# EAGLE board signal_distribution_board (EAGLE 9.6.2), part 1 of 2
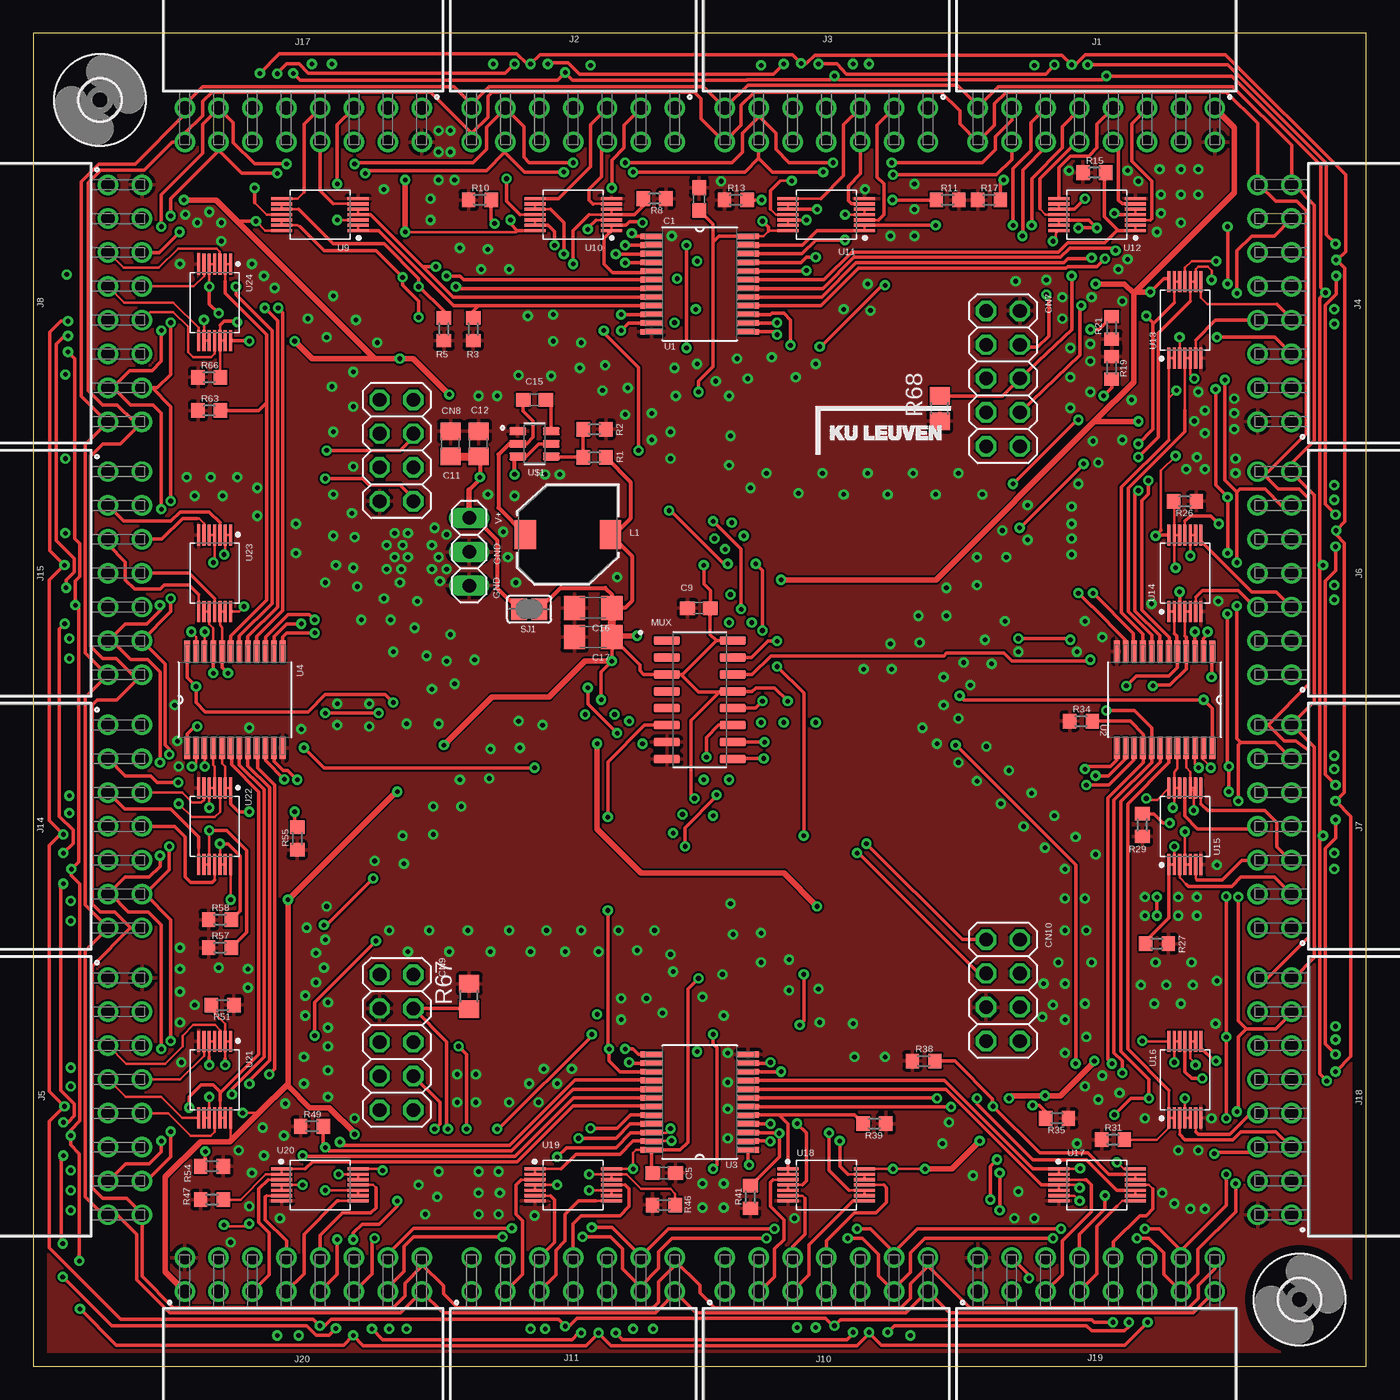
[diagram p9: board, top side]
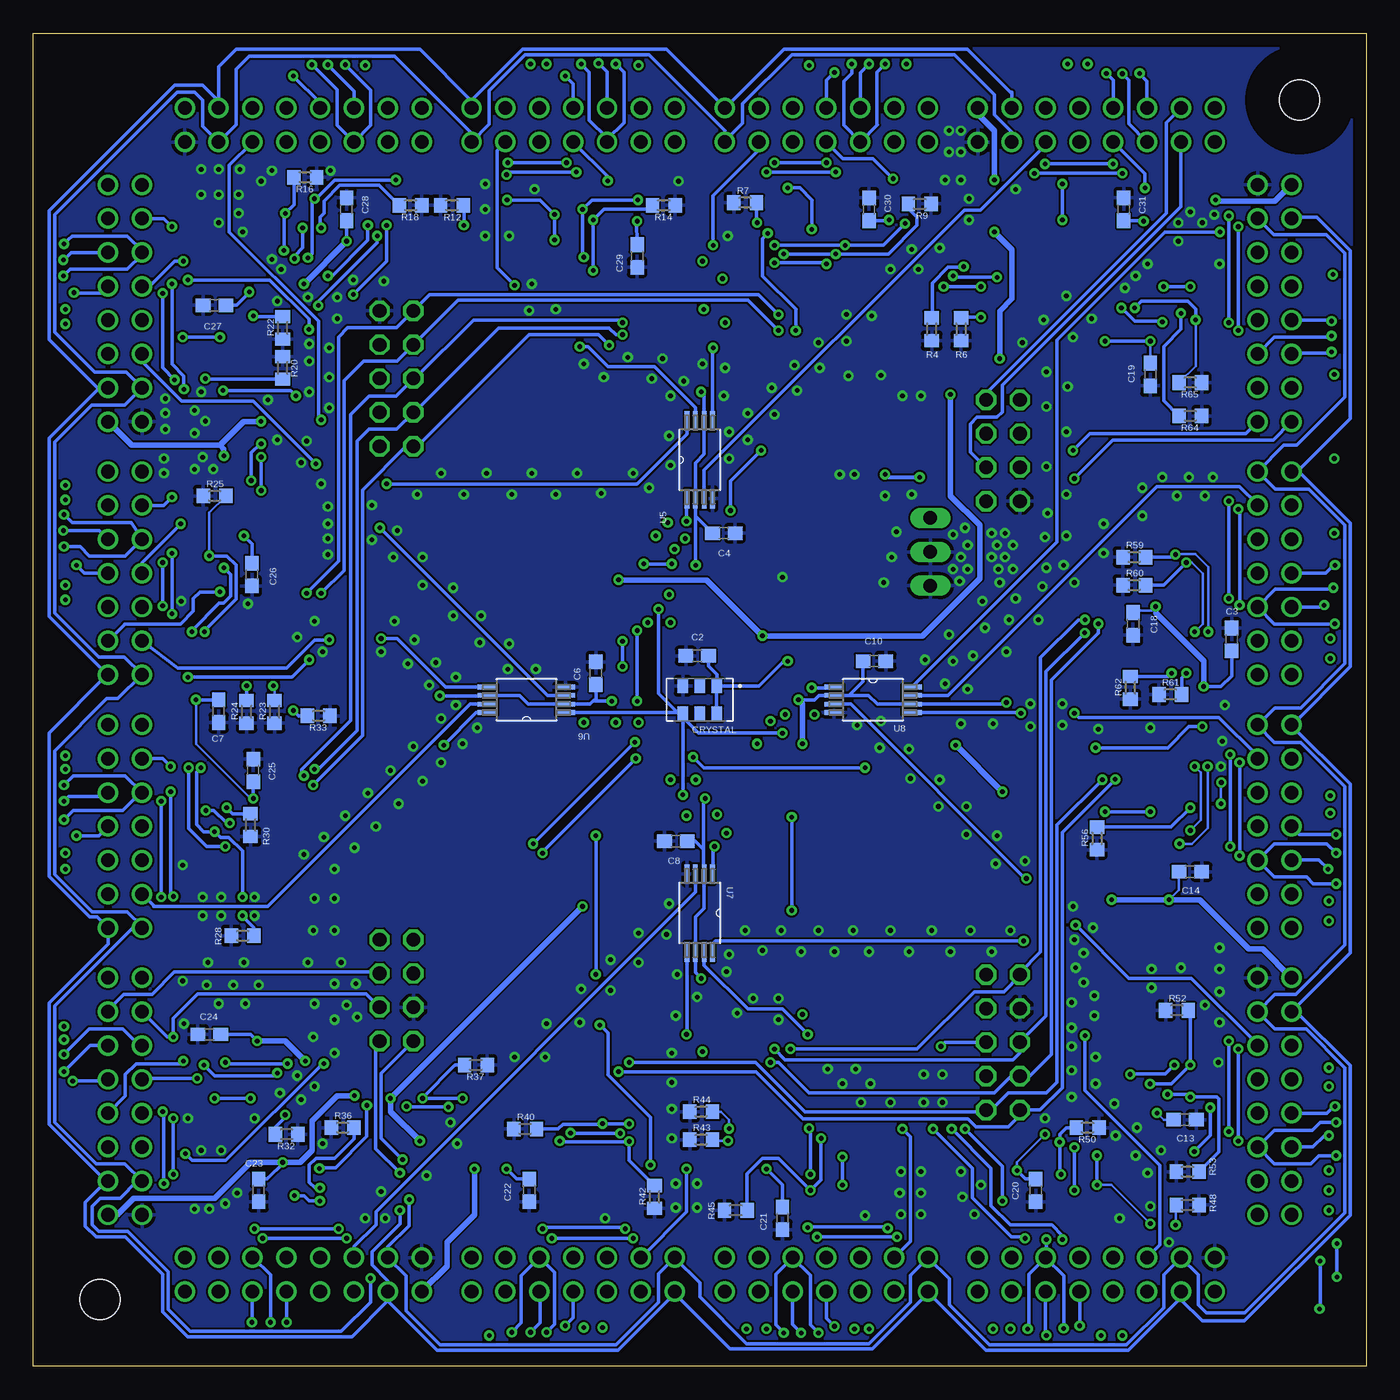
[diagram p10: board, bottom side, seen from below]

Size 100 x 100 mm. Coordinates in mm from the lower left corner, seen from the top.
Outline: 0,0 100,0 100,100 0,100 0,0
Copper layers (1*16): Top 0.035mm / dielectric 1.5mm / Bottom 0.035mm
Design rules "default": minimum track width 6mil, minimum drill 0.35mm, track to track 6mil, track to pad 6mil, pad to pad 6mil, via to via 6mil, smd to smd 6mil, copper to edge 40mil, drill to drill 6mil, minimum pad ring 10mil, minimum via ring 8mil, stop-mask expansion 4mil, vias tented up to drill 0mil, thermal gap 10mil

## Footprints (pad centres in the part's own frame; a part is rotated, then mirrored left to right if it is on the bottom)
C0603 = smd 1.1 x 1: 1 -0.85,0; 2 0.85,0
C0805 = smd 1.3 x 1.5: 1 -0.95,0; 2 0.95,0
C1206 = smd 1.6 x 1.8: 1 -1.4,0; 2 1.4,0
2X05 = drill 1.016 octagon: 1 -5.08,-1.27; 2 -5.08,1.27; 3 -2.54,-1.27; 4 -2.54,1.27; 5 0,-1.27; 6 0,1.27; 7 2.54,-1.27; 8 2.54,1.27; 9 5.08,-1.27; 10 5.08,1.27
2X04 = drill 1.016 octagon: 1 -3.81,-1.27; 2 -3.81,1.27; 3 -1.27,-1.27; 4 -1.27,1.27; 5 1.27,-1.27; 6 1.27,1.27; 7 3.81,-1.27; 8 3.81,1.27
OSC_ECX-H35CM-75.000 = smd 0.8 x 1.1: 1 -1.27,-1.05; 2 0,-1.05; 3 1.27,-1.05; 4 1.27,1.05; 5 0,1.05; 6 -1.27,1.05
3,0 = hole 3: 0,0
613016243121 = drill 1.02: 1 -8.89,5.61; 2 -8.89,8.15; 3 -6.35,5.61; 4 -6.35,8.15; 5 -3.81,5.61; 6 -3.81,8.15; 7 -1.27,5.61; 8 -1.27,8.15; 9 1.27,5.61; 10 1.27,8.15; 11 3.81,5.61; 12 3.81,8.15; 13 6.35,5.61; 14 6.35,8.15; 15 8.89,5.61; 16 8.89,8.15
613014243121 = drill 1.02: 1 -7.62,5.61; 2 -7.62,8.15; 3 -5.08,5.61; 4 -5.08,8.15; 5 -2.54,5.61; 6 -2.54,8.15; 7 0,5.61; 8 0,8.15; 9 2.54,5.61; 10 2.54,8.15; 11 5.08,5.61; 12 5.08,8.15; 13 7.62,5.61; 14 7.62,8.15
1X03 = drill 1.016 long: 1 -2.54,0; 2 0,0; 3 2.54,0
WE-PD_7345P = smd 1.6 x 2.2: 1 -3.2,0; 2 3.2,0
SOIC127P600X175-16N = smd 1.97 x 0.6: 1 -2.475,4.445; 2 -2.475,3.175; 3 -2.475,1.905; 4 -2.475,0.635; 5 -2.475,-0.635; 6 -2.475,-1.905; 7 -2.475,-3.175; 8 -2.475,-4.445; 9 2.475,-4.445; 10 2.475,-3.175; 11 2.475,-1.905; 12 2.475,-0.635; 13 2.475,0.635; 14 2.475,1.905; 15 2.475,3.175; 16 2.475,4.445
R0603 = smd 1 x 1.1: 1 -0.85,0; 2 0.85,0
R0805 = smd 1.3 x 1.5: 1 -0.95,0; 2 0.95,0
SJ = smd 1.168 x 1.6: 1 -0.762,0; 2 0.762,0
SOP65P780X200-24N = smd 1.651 x 0.432: 1 -3.632,3.581; 2 -3.632,2.921; 3 -3.632,2.286; 4 -3.632,1.626; 5 -3.632,0.965; 6 -3.632,0.33; 7 -3.632,-0.33; 8 -3.632,-0.965; 9 -3.632,-1.626; 10 -3.632,-2.286; 11 -3.632,-2.921; 12 -3.632,-3.581; 13 3.632,-3.581; 14 3.632,-2.921; 15 3.632,-2.286; 16 3.632,-1.626; 17 3.632,-0.965; 18 3.632,-0.33; 19 3.632,0.33; 20 3.632,0.965; 21 3.632,1.626; 22 3.632,2.286; 23 3.632,2.921; 24 3.632,3.581
SOP65P640X120-8N = smd 1.473 x 0.356: 1 -2.921,0.965; 2 -2.921,0.33; 3 -2.921,-0.33; 4 -2.921,-0.965; 5 2.921,-0.965; 6 2.921,-0.33; 7 2.921,0.33; 8 2.921,0.965
SOP40P640X120-14N = smd 1.57 x 0.24: 1 -2.87,1.2; 2 -2.87,0.8; 3 -2.87,0.4; 4 -2.87,0; 5 -2.87,-0.4; 6 -2.87,-0.8; 7 -2.87,-1.2; 8 2.87,-1.2; 9 2.87,-0.8; 10 2.87,-0.4; 11 2.87,0; 12 2.87,0.4; 13 2.87,0.8; 14 2.87,1.2
SOT95P280X110-6N = smd 1.25 x 0.59: 1 -1.255,0.95; 2 -1.255,0; 3 -1.255,-0.95; 4 1.255,-0.95; 5 1.255,0; 6 1.255,0.95

## Placement (x,y rotation side)
C1  1u  [C0603]  49.95,87.57 90 top
C2  100n  [C0603]  50.2,53.3 180 bottom
C3  1u  [C0603]  10.1,54.53 90 bottom
C4  100n  [C0603]  48.2,62.5 0 bottom
C5  1u  [C0603]  47.33,14.49 0 top
C6  100n  [C0603]  57.8,52 90 bottom
C7  1u  [C0603]  86.1,49.14 270 bottom
C8  100n  [C0603]  51.8,39.4 180 bottom
C9  100n  [C0603]  49.93,56.87 0 top
C10  100n  [C0603]  36.9,52.9 0 bottom
C11  10u  [C0805]  31.3,69.2 90 top
C12  10u  [C0805]  33.4,69.2 90 top
C13  100n  [C0603]  13.6,18.5 0 bottom
C14  100n  [C0603]  13.2,37.1 0 bottom
C15  100n  [C0603]  37.6,72.5 180 top
C16  22u  [C1206]  42,56.9 180 top
C17  22u  [C1206]  42,54.7 180 top
C18  100n  [C0603]  17.5,55.7 270 bottom
C19  100n  [C0603]  16.2,74.4 270 bottom
C20  100n  [C0603]  24.8,13.2 270 bottom
C21  100n  [C0603]  43.8,11.1 270 bottom
C22  100n  [C0603]  62.8,13.2 270 bottom
C23  100n  [C0603]  83.1,13.2 270 bottom
C24  100n  [C0603]  86.8,24.9 180 bottom
C25  100n  [C0603]  83.5,44.7 90 bottom
C26  100n  [C0603]  83.6,59.4 270 bottom
C27  100n  [C0603]  86.4,79.6 180 bottom
C28  100n  [C0603]  76.5,86.8 90 bottom
C29  100n  [C0603]  54.7,83.3 270 bottom
C30  100n  [C0603]  37.3,86.8 90 bottom
C31  100n  [C0603]  18.2,86.8 90 bottom
CN7  [2X05]  72.75,74.1 270 top
CN8  [2X04]  27.25,68.7 270 top
CN9  [2X05]  27.25,24.3 270 top
CN10  [2X04]  72.75,28.2 270 top
CRYSTAL  ECX-H35CM-75.000  [OSC_ECX-H35CM-75.000]  50,50 180 bottom
H1  MOUNT-HOLE3.0  [3,0]  5,95 0 top
H2  MOUNT-HOLE3.0  [3,0]  95,5 0 top
J1  [613016243121]  79.75,100 180 top
J2  [613014243121]  40.5,100 180 top
J3  [613014243121]  59.5,100 180 top
J4  [613016243121]  100,79.75 90 top
J5  [613016243121]  0,20.25 270 top
J6  [613014243121]  100,59.5 90 top
J7  [613014243121]  100,40.5 90 top
J8  [613016243121]  0,79.75 270 top
J10  [613014243121]  59.5,0 0 top
J11  [613014243121]  40.5,0 0 top
J14  [613014243121]  0,40.5 270 top
J15  [613014243121]  0,59.5 270 top
J17  [613016243121]  20.25,100 180 top
J18  [613016243121]  100,20.25 90 top
J19  [613016243121]  79.75,0 0 top
J20  [613016243121]  20.25,0 0 top
JP1  [1X03]  32.7,61.1 270 top
L1  3.3uH  [WE-PD_7345P]  40.1,62.4 0 top
MUX  CD74HC4052M96  [SOIC127P600X175-16N]  50,50 0 top
R1  33k  [R0603]  42.1,68.2 0 top
R2  10k  [R0603]  42.1,70.3 180 top
R3  1k  [R0603]  33,77.8 90 top
R4  1k  [R0603]  32.6,77.8 90 bottom
R5  1k  [R0603]  30.8,77.8 90 top
R6  1k  [R0603]  30.4,77.8 90 bottom
R7  1k  [R0603]  46.6,87.3 0 bottom
R8  1k  [R0603]  46.6,87.6 180 top
R9  1k  [R0603]  33.5,87.2 180 bottom
R10  1k  [R0603]  33.5,87.5 0 top
R11  1k  [R0603]  68.6,87.5 180 top
R12  1k  [R0603]  68.6,87.1 0 bottom
R13  1k  [R0603]  52.7,87.5 0 top
R14  1k  [R0603]  52.7,87.1 180 bottom
R15  1k  [R0603]  79.6,89.55 0 top
R16  1k  [R0603]  79.6,89.2 180 bottom
R17  1k  [R0603]  71.7,87.5 0 top
R18  1k  [R0603]  71.7,87.1 180 bottom
R19  1k  [R0603]  80.9,74.9 270 top
R20  1k  [R0603]  81.3,74.9 270 bottom
R21  1k  [R0603]  80.9,77.9 90 top
R22  1k  [R0603]  81.3,77.9 90 bottom
R23  1k  [R0603]  81.9,49.1 90 bottom
R24  1k  [R0603]  84,49.1 90 bottom
R25  1k  [R0603]  86.4,65.3 0 bottom
R26  1k  [R0603]  86.4,64.9 180 top
R27  1k  [R0603]  84.3,31.7 180 top
R28  1k  [R0603]  84.3,32.3 0 bottom
R29  1k  [R0603]  83.2,40.6 90 top
R30  1k  [R0603]  83.7,40.6 90 bottom
R31  1k  [R0603]  81,17 0 top
R32  1k  [R0603]  81,17.4 180 bottom
R33  1k  [R0603]  78.6,48.8 180 bottom
R34  1k  [R0603]  78.6,48.4 0 top
R35  1k  [R0603]  76.8,18.6 180 top
R36  1k  [R0603]  76.8,17.9 0 bottom
R37  1k  [R0603]  66.8,22.6 180 bottom
R38  1k  [R0603]  66.8,22.9 0 top
R39  1k  [R0603]  63.1,18.2 180 top
R40  1k  [R0603]  63.1,17.8 0 bottom
R41  1k  [R0603]  53.8,12.7 90 top
R42  1k  [R0603]  53.4,12.7 90 bottom
R43  1k  [R0603]  49.9,17 0 bottom
R44  1k  [R0603]  49.9,19.1 0 bottom
R45  1k  [R0603]  47.3,11.7 0 bottom
R46  1k  [R0603]  47.3,12.1 0 top
R47  1k  [R0603]  13.4,12.5 0 top
R48  1k  [R0603]  13.4,12.1 180 bottom
R49  1k  [R0603]  20.9,18 0 top
R50  1k  [R0603]  20.9,17.9 180 bottom
R51  1k  [R0603]  14.2,27.1 180 top
R52  1k  [R0603]  14.2,26.7 0 bottom
R53  1k  [R0603]  13.4,14.6 0 bottom
R54  1k  [R0603]  13.4,15 180 top
R55  1k  [R0603]  19.8,39.6 90 top
R56  1k  [R0603]  20.2,39.6 90 bottom
R57  1k  [R0603]  14,31.4 0 top
R58  1k  [R0603]  14,33.5 0 top
R59  1k  [R0603]  17.4,60.7 0 bottom
R60  1k  [R0603]  17.4,58.6 0 bottom
R61  1k  [R0603]  14.7,50.4 0 bottom
R62  1k  [R0603]  17.7,50.9 90 bottom
R63  1k  [R0603]  13.2,71.7 0 top
R64  1k  [R0603]  13.2,71.3 180 bottom
R65  1k  [R0603]  13.2,73.8 180 bottom
R66  1k  [R0603]  13.2,74.2 0 top
R67  2.2k  [R0805]  32.7,27.75 90 top
R68  2.2k  [R0805]  68,71.85 90 top
SJ1  [SJ]  37.2,56.8 0 top
U1  CD74HC4067SM96  [SOP65P780X200-24N]  50,81.19 0 top
U2  CD74HC4067SM96  [SOP65P780X200-24N]  84.87,50 270 top
U3  CD74HC4067SM96  [SOP65P780X200-24N]  50,19.81 180 top
U4  CD74HC4067SM96  [SOP65P780X200-24N]  15.13,50 90 top
U5  CDCV304PW  [SOP65P640X120-8N]  50,68 90 bottom
U6  CDCV304PW  [SOP65P640X120-8N]  63,50 180 bottom
U7  CDCV304PW  [SOP65P640X120-8N]  50,34 270 bottom
U8  CDCV304PW  [SOP65P640X120-8N]  37,50 0 bottom
U9  SN74LV00ADGVR  [SOP40P640X120-14N]  21.5,86.4 180 top
U10  SN74LV00ADGVR  [SOP40P640X120-14N]  40.5,86.4 180 top
U11  SN74LV00ADGVR  [SOP40P640X120-14N]  59.5,86.4 180 top
U12  SN74LV00ADGVR  [SOP40P640X120-14N]  79.8,86.4 180 top
U13  SN74LV00ADGVR  [SOP40P640X120-14N]  86.4,78.5 90 top
U14  SN74LV00ADGVR  [SOP40P640X120-14N]  86.4,59.5 90 top
U15  SN74LV00ADGVR  [SOP40P640X120-14N]  86.4,40.5 90 top
U16  SN74LV00ADGVR  [SOP40P640X120-14N]  86.4,21.5 90 top
U17  SN74LV00ADGVR  [SOP40P640X120-14N]  79.8,13.6 0 top
U18  SN74LV00ADGVR  [SOP40P640X120-14N]  59.5,13.6 0 top
U19  SN74LV00ADGVR  [SOP40P640X120-14N]  40.5,13.6 0 top
U20  SN74LV00ADGVR  [SOP40P640X120-14N]  21.5,13.6 0 top
U21  SN74LV00ADGVR  [SOP40P640X120-14N]  13.6,21.5 270 top
U22  SN74LV00ADGVR  [SOP40P640X120-14N]  13.6,40.5 270 top
U23  SN74LV00ADGVR  [SOP40P640X120-14N]  13.6,59.5 270 top
U24  SN74LV00ADGVR  [SOP40P640X120-14N]  13.6,79.8 270 top
U$1  TPS562209  [SOT95P280X110-6N]  37.6,69.2 0 top

## Tracks (layer width: path | path; a pad name or v marks a point on that pad's centre or on a via)
+3V3  (via drill 0.35)
  Top 0.2: 36.1,85.1 36.2,85.1 36.3,85.2 | U19.14 v45,14.8 45,16 45.23,16.23 U3.24
  Top 0.203: U10.14 36.7,85.2 | v27.9,85.1 36.1,85.1 | U22.14 v14.8,35 | U21.14 14.8,16.9 | U20.14 26.09,14.8 v26.2,14.69 | v15.8,57 15.43,56.63 U23.14 | U18.14 v64.5,14.8 v66.9,14.8 | U17.14 81.8,14.8 v81.3,15.3 | U16.14 83.23,24.37 v83.2,24.4 | U13.14 85.2,81.6 | U12.14 76.7,84.97 76.7,84.6 v76.5,84.4 | U1.24 54.77,84.77 55.15,85.15 55.2,85.2 U11.14 | v85.7,68.3 84.6,67.2 84.6,62.77 | U15.14 84.33,42.5 83.6,42.5 v83.5,42.6 | U9.14 17.4,85.2 v16.7,85.9 | v15.7,19 16.9,19 16.95,19.05
  Top 0.254: MUX.3 48.7,51.91 51.24,54.45 | 51.24,54.45 MUX.16 | MUX.3 48.59,51.91 49.9,50.6 52.44,50.6 MUX.13 | U4.24 11.55,51.65 v12.2,51 12.2,49.8 12.9,49.1 20.6,49.1 21.9,50.4 26.4,50.4 v27,49.8 | U2.24 88.45,49.35 v87.8,50 69.8,50 v69.5,50.3 | C5.1 46.37,14.92 U3.24 48.53,16.23 49.1,16.8 49.1,28.3 v49.9,29.1 | U1.24 51.43,84.77 51,84.34 | v49.9,73.1 49.9,73.9 51,75 51,84.34 | 51.24,54.45 50.78,54.91 C9.2 50.8,56.89 50.8,58.2 50.3,58.7 v50.3,60.1 | MUX.13 51.53,50.63 49.34,48.44 49.34,42.86 v49.6,42.6 | MUX.3 45.8,51.91 45.5,52.2 45.5,52.6 C17.1 v43.4,52.9 42.6,52.1 v42.6,50 | MUX.13 53.94,50.63 54.2,50.9 55.6,50.9 v56.6,49.9 | U24.14 16.17,76.93 v16.2,76.9 | v83.8,80.6 84.8,81.6 85.2,81.6 | v54.7,85.9 55.15,85.45 55.15,85.15 | v35.8,86 35.8,85.7 36.3,85.2 36.7,85.2 | v16.7,85.9 15.3,85.9 15.25,85.95 | 51,84.34 51,85.67 C1.1 | U14.14 84.27,62.37 v84.2,62.3 84.6,62.7 84.6,62.77
  Top 0.305: R1.2 44.8,66.35 44.8,63.6 43.6,62.4 L1.2 44.9,60.8 44.9,57.4 44.4,56.9 C16.1 43.4,57.9 42.9,58.4 39.56,58.4 SJ1.2
  Top 0.406: v11.3,87.5 13.7,87.5 15.25,85.95 25.6,75.6 | v27.9,89 v27.9,85.1 | 25.6,75.6 v27.5,75.6 28.5,75.6 v31.2,72.9 | v19.6,76.9 20.9,75.6 25.6,75.6 | J20.1 9.9,7.07 9.9,14.2 12.54,16.84 14.74,16.84 14.8,16.9 16.95,19.05 19.1,21.2 | 19.1,21.2 v19.1,35 27.2,43.1 v27.3,43.1 | v24.1,17.4 24.1,17.5 22.2,19.4 20.74,19.4 19.1,21.04 19.1,21.2 | v71,16.9 68.9,14.8 v66.9,14.8 | v73.2,20.1 73.4,20.3 v75.9,20.3 77.06,20.3 79.6,22.84 v79.6,22.9 | J1.1 90.1,92.93 90.1,88.06 82.64,80.6 | 79.6,70.9 67.7,59 v56.1,59 | v79.7,81.2 81.86,81.2 82.55,80.51 | v82.92,70.89 79.61,70.89 79.6,70.9 | v45.3,54.8 43.5,54.8 C17.1 | v30.8,46.6 34.4,50.2 38.7,50.2 41.4,52.9 v43.4,52.9 | v58.8,34.5 56.3,37 45.6,37 42.3,40.3 v42.3,46.7 | 82.55,80.51 82.55,73.85 79.6,70.9 | v83.8,80.6 82.64,80.6 | 82.64,80.6 82.55,80.51
  Top 0.61: C17.1 C16.1
  Bottom 0.203: v26.2,14.69 26.2,15.3 v24.1,17.4 | v87.8,50 87.8,46.7 83.7,42.6 v83.5,42.6 | C19.1 v16.2,76.9 | v15.8,57 16.1,56.7 17.35,56.7 C18.1 | C14.1 14.05,35.75 v14.8,35 | C13.1 15.2,18.5 v15.7,19
  Bottom 0.254: U5.2 50.33,67.77 49.67,68.43 U5.6 49.67,72.87 v49.9,73.1 | 38.8,50.33 U8.2 41.07,50.33 41.4,50 v42.6,50 | 38.8,50.33 37.33,50.33 36.67,49.67 U8.6 27.13,49.67 v27,49.8 | v12.2,51 10.9,51 10.1,51.8 C3.1 | v87.8,50 87.3,50 87.29,49.99 C7.1 | v69.5,50.3 65.95,50.3 U6.6 63.53,50.33 62.87,49.67 U6.2 58.23,49.67 58,49.9 | v49.9,29.1 50.33,29.53 U7.6 50.33,33.7 49.67,34.35 U7.2 49.72,36.97 49.72,38.77 | CRYSTAL.1 CRYSTAL.6 | C2.1 49.35,52.55 48.7,51.9 48.7,51.08 CRYSTAL.1 | U5.2 50.33,60.13 v50.3,60.1 | v49.6,42.6 49.72,42.48 49.72,38.77 | CRYSTAL.1 45.55,51.05 43.7,52.9 v43.4,52.9 | v56.6,49.9 58,49.9 | C4.1 50.33,63.78 U5.2 | C6.1 57.8,50.1 58,49.9 | C8.1 50.35,39.4 49.72,38.77 | C10.1 37.75,51.38 38.8,50.33 | v16.2,76.9 v19.6,76.9 | C20.1 25.57,14.05 v26.2,14.69 | C21.1 43.8,13.6 v45,14.8 | C22.1 63.75,14.05 v64.5,14.8 | C23.1 82.45,14.05 81.2,15.3 | C24.1 83.7,24.9 v83.2,24.4 | C26.1 83.6,61.7 v84.2,62.3 | C27.1 84.75,79.6 83.8,80.55 v83.8,80.6 | C28.1 v76.5,84.4 | C29.1 54.75,85.95 v54.7,85.9 | C30.1 35.85,85.95 v35.8,86 | C31.1 16.75,85.95 v16.7,85.9 | v83.5,42.6 C25.1
  Bottom 0.406: J8.1 6.85,87.4 11.2,87.4 v11.3,87.5 | J17.1 29.14,93.94 27.9,92.7 v27.9,89 | v27.5,75.6 27.5,79.16 26.57,80.1 26.57,83.77 v27.9,85.1 | J5.1 7.77,31.3 8.8,31.3 12.5,35 v14.8,35 v19.1,35 | v12.2,51 12.2,52.9 15.8,56.5 v15.8,57 | J19.1 68.96,7.51 68.96,9.31 66.9,11.37 v66.9,14.8 | v71,16.9 73.2,19.1 v73.2,20.1 v58.8,34.5 | J18.1 93.69,11.36 92.45,12.6 86.4,12.6 83.7,15.3 v81.3,15.3 81.2,15.3 80,15.3 79.1,16.2 79.1,18.4 77.2,20.3 v75.9,20.3 | v83.2,24.4 81.1,24.4 v79.6,22.9 | v76.5,84.4 v79.7,81.2 | J4.1 92.63,69.1 86,69.1 | 86,69.1 84.22,70.89 v82.92,70.89 | 86,69.1 85.7,68.8 v85.7,68.3 | v31.2,72.9 31.2,65.3 29,63.1 29,59.1 33.3,54.8 v45.3,54.8 49.5,59 v56.1,59 | v30.8,46.6 v27.3,43.1 | v42.6,50 42.3,49.7 v42.3,46.7
A0_A  (via drill 0.35)
  Top 0.254: MUX.12 54.16,49.37 v54.7,49.9 | v45.4,68.7 45.4,74.9 42.8,77.5 v42.8,77.7 | U1.1 45.13,84.77 v44.9,85 | v47.7,64.2 47.8,64.2 51.8,60.2 v52.1,60.2 | v54.7,55.2 54.7,59.7 v54.2,60.2
  Bottom 0.254: v45.4,68.7 47.7,66.4 v47.7,64.2 | v42.8,77.7 42.8,79.3 45.3,81.8 45.3,84.6 v44.9,85 | v54.7,49.9 v54.7,55.2 | v54.2,60.2 v52.1,60.2
A1_A  (via drill 0.35)
  Top 0.254: MUX.14 52.48,51.9 53.93,51.9 55.34,53.3 68.3,53.3 68.5,53.5 72.8,53.5 73.4,52.9 79.2,52.9 v79.3,53 | v88.4,51.7 88.4,53.58 U2.1
  Bottom 0.254: v79.3,53 80.6,51.7 v88.4,51.7
A2_A  (via drill 0.35)
  Top 0.254: MUX.15 53.88,53.17 55.1,54.4 v55.8,54.4 | v53.7,15.1 53.63,15.17 U3.1 | v57.8,39.8 57.8,50.5 v55.8,52.5 | v57.8,29.4 57.8,25.9 v57.5,25.6
  Bottom 0.254: v55.8,54.4 v55.8,52.5 | v57.5,25.6 56.9,25 56.9,21.87 53.7,18.67 v53.7,15.1 | v57.8,39.8 v57.8,29.4
A3_A  (via drill 0.35)
  Top 0.254: v50.5,45.7 50.5,47.19 51.41,48.09 MUX.11 | v37.6,44.9 21.8,44.9 v20.3,46.4 | v12.3,48 12.1,48 11.55,47.45 U4.1
  Bottom 0.254: v50.5,45.7 49.7,44.9 v37.6,44.9 | v20.3,46.4 14.9,46.4 13.3,48 v12.3,48
DIN_2  (via drill 0.35)
  Top 0.254: v18.3,96.96 18.3,97 19,97.7 19.94,97.7 20.64,97 35.4,97 v36.1,97.7 | v38.6,97.7 38.7,97.8 40.11,97.8 40.99,96.91 55.51,96.91 v56.3,97.7 | v58.9,97.7 60.3,97.7 61,96.93 75.96,96.93 v76.6,97.64 | v97.74,81.8 97.76,81.78 97.76,80.43 96.92,79.59 96.92,64.68 v97.7,63.9 | v97.7,61.5 97.7,59.7 96.92,58.92 96.92,44.38 v97.7,43.6 | v97.7,23.4 96.92,24.18 96.92,38.83 97.72,39.63 97.72,40.98 v97.7,41 | v97.7,84.2 97.01,84.89 97.01,90.27 89.63,97.64 v79.1,97.64 | CN7.8 78.53,75.87 78.53,79.47 v78.62,79.58 | J1.12 75.94,91.45 74.24,89.75 74.24,84.84 v74.2,84.8
  Bottom 0.254: v18.3,96.96 17.8,96.46 17.8,93.21 J17.12 | v38.6,97.7 38.6,97 39.2,96.4 39.2,93.09 J2.10 36.68,93.13 36.7,93.16 36.7,97.1 v36.1,97.7 | v58.9,97.7 58.3,97.1 58.3,93.49 56.96,92.15 J3.10 56.96,92.05 55.7,93.31 55.7,97.1 v56.3,97.7 | v79.1,97.64 77.21,95.75 77.21,93.12 J1.12 74.7,93.09 74.7,95.74 v76.6,97.64 | v97.7,84.2 97.1,84.8 92.96,84.8 91.85,83.69 J4.12 91.85,83.39 92.94,82.3 97.24,82.3 v97.74,81.8 | v97.7,63.9 97.1,63.3 92.67,63.3 J6.10 93.09,60.8 95.8,60.8 96.5,61.5 v97.7,61.5 | v97.7,41 97,41.7 93.29,41.7 91.95,43.04 J7.10 93.11,44.3 97,44.3 v97.7,43.6 | v97.7,23.4 95.8,25.3 93.3,25.3 92.06,24.06 J18.12 | v78.62,79.58 78.62,79.88 74.2,84.3 v74.2,84.8
DIN_5  (via drill 0.35)
  Top 0.254: v2.26,36.2 2.06,36 2.06,20.71 3.09,19.68 3.09,18.77 2.61,18.3 v2.26,18.3 | v2.36,55.7 1.96,55.3 1.96,41.24 2.99,40.21 2.99,39.23 v2.26,38.5 | v2.6,77.3 2.3,77.3 1.7,76.7 1.7,61.96 3.06,60.6 3.06,59.6 2.46,59 v2.46,58.4 | v82.2,3.3 82.2,2.97 81.87,2.64 79.4,2.64 79,3.04 64.6,3.04 v64.1,2.54 | v43.7,2.5 44.2,2 61.06,2 61.5,2.44 v61.5,2.54 | v25.4,2.8 26.2,2 40.4,2 40.9,2.5 v41.1,2.5 | v22.7,2.84 22.2,2.34 21.2,2.34 20.5,3.04 5.86,3.04 v2.2,6.7 | v2.2,9.2 2.1,9.3 2.1,15.64 v2.26,15.8 | CN9.8 30.5,19.78 30.5,18.2 v30.1,17.8 | v24,9.5 24,10 24.66,10.66 25.96,10.66 27.3,12 v27.3,12.4
  Bottom 0.254: v2.26,36.2 3.96,36.2 4.46,36.7 6.89,36.7 J14.10 6.91,39.2 2.96,39.2 v2.26,38.5 | v2.26,18.3 3.46,18.3 4.06,17.7 6.89,17.7 J5.12 6.91,15.2 4.16,15.2 3.56,15.8 v2.26,15.8 | v2.6,77.3 2.7,77.2 6.89,77.2 J8.12 | v2.46,58.4 2.56,58.3 6.81,58.3 J15.10 6.89,55.7 v2.36,55.7 | v82.2,3.3 82.2,6.86 83.49,8.15 J19.12 | v64.1,2.54 63.4,3.24 63.4,6.78 62.04,8.14 J10.10 61.99,8.15 60.9,7.06 60.9,3.14 v61.5,2.54 | v43.7,2.5 44.3,3.1 44.3,6.89 J11.10 43.02,8.15 41.7,6.83 41.7,3.1 v41.1,2.5 | v25.4,2.8 25.3,2.9 25.3,6.91 J20.12 | v2.2,6.7 v2.2,9.2 | J20.12 22.7,6.79 v22.7,2.84 | J20.12 24,8.21 v24,9.5 | v30.1,17.8 27.3,15 v27.3,12.4
FSELECT  (via drill 0.35)
  Top 0.254: v72.5,14.5 v72.5,11.7
  Bottom 0.254: J17.3 26.6,95.6 26.7,95.6 29.91,98.81 43.69,98.81 J2.1 48.12,94.42 52.51,98.81 63.29,98.81 67.12,94.97 J3.1 67.12,94.92 71,98.8 84.8,98.8 86.1,97.5 J1.3 86.1,94.9 87.3,96.1 89.4,96.1 98.81,86.69 98.81,77.01 95.2,73.4 J4.3 95.02,73.4 98.81,69.61 98.81,56.23 94.45,51.88 J6.1 94.44,51.88 98.81,47.51 98.81,45.99 98.81,45.83 98.81,45.82 98.81,36.73 95.77,33.69 95.2,33.69 J7.1 94.39,31.68 98.81,27.26 98.81,18.13 94.58,13.9 J18.3 94.5,13.9 96.1,12.3 96.1,10.5 95.3,9.7 93.1,9.7 90.3,6.9 90.3,4.1 88.4,2.2 76.1,2.2 73.4,4.9 J19.3 | J19.3 73.43,5.58 73.43,4.91 69.71,1.19 56.13,1.19 51.88,5.45 51.88,5.46 | 51.88,5.46 47.71,1.29 37.05,1.29 32.88,5.46 32.88,5.56 | 51.88,5.46 J10.1 | 32.88,5.56 J11.1 | 32.88,5.56 28.51,1.19 17.83,1.19 13.9,5.12 J20.3 13.9,5 12.3,3.4 9.12,3.4 1.19,11.33 1.19,22.57 5.22,26.6 J5.3 1.19,31.02 1.19,43.67 5.61,48.09 J14.1 5.56,48.12 1.19,52.49 1.19,63.27 5.04,67.12 J15.1 5.16,67.12 1.19,71.09 1.19,83.69 3.7,86.2 5.51,86.2 J8.3 | J19.3 73.4,6.41 74.6,7.61 74.6,8.6 72.5,10.7 v72.5,11.7 | v72.5,14.5 74.32,16.32 74.32,24.09 CN10.8
FSYNC1_A  (via drill 0.35)
  Top 0.203: v22.8,86 U9.3
  Top 0.254: v22.8,88.7 22.8,93.13 J17.5
  Bottom 0.254: v22.8,88.7 v22.8,86
FSYNC1_B  (via drill 0.35)
  Top 0.203: U13.3 v86,77.2
  Top 0.254: v88.8,77.2 93.16,77.2 94.39,75.97 J4.5
  Bottom 0.254: v86,77.2 v88.8,77.2
FSYNC1_C
  Top 0.203: U17.3 78.9,14
  Top 0.254: J19.5 77.2,6.87 77.2,9.4 79.38,11.58 79.38,13.62 79,14 78.9,14
FSYNC1_D
  Top 0.203: J5.5 6.97,22.7 9.9,22.7 11.2,24 11.2,24.8 12,25.6 13.63,25.6 14.03,25.21 14.03,24.4 U21.3
FSYNC2_A
  Top 0.203: U9.6 22.5,87.2
  Top 0.254: 22.5,87.2 21.52,88.18 J17.8
FSYNC2_B
  Top 0.203: U13.6 87.2,77
  Top 0.254: J4.8 88.68,78.48 87.2,77
FSYNC2_C  (via drill 0.35)
  Top 0.203: v78.5,12.4 78.1,12.8 U17.6
  Top 0.254: J19.8 78.48,9.9 80.39,11.81 80.39,12.8 v80.4,12.8
  Bottom 0.254: v80.4,12.8 79.7,12.8 79.3,12.4 v78.5,12.4
FSYNC2_D
  Top 0.203: J5.8 11.02,21.52 12.8,23.3 U21.6
FSYNC3_A
  Top 0.203: 20.3,88.07 19.83,87.6 U9.8
  Top 0.254: 20.3,88.07 20.3,93.17 J17.7
FSYNC3_B
  Top 0.203: 93.3,79.7 88.07,79.7 87.6,80.17 U13.8
  Top 0.254: 93.3,79.7 94.39,78.61 J4.7
FSYNC3_C
  Top 0.203: U17.8 81.7,12.4 81.3,12
  Top 0.254: 81.3,12 79.8,10.5 79.8,6.93 J19.7
FSYNC3_D
  Top 0.203: J5.7 6.93,20.2 9.6,20.2 11.17,18.63 U21.8
FSYNC4_A  (via drill 0.35)
  Top 0.203: U9.11 17.5,86.4 16.6,87.3
  Top 0.254: 16.6,87.3 v16.6,88.4
  Bottom 0.254: v16.6,88.4 16.6,89.47 J17.10
FSYNC4_B  (via drill 0.35)
  Top 0.203: U13.11 86.4,82.4 86.9,82.9 v88.74,82.9
  Bottom 0.254: J4.10 91.28,81.02 89.4,82.9 v88.74,82.9
FSYNC4_C
  Top 0.203: 84,13.3 83.7,13.6 U17.11
  Top 0.254: J19.10 81.02,9.32 83,11.3 83.5,11.3 84,11.8 84,13.3
FSYNC4_D
  Top 0.203: J5.10 10.12,18.98 11.8,17.3 13.3,17.3 13.6,17.6 U21.11
FSYNC5_A  (via drill 0.35)
  Top 0.203: 42.2,86 U10.3
  Top 0.254: 42.2,86 41.6,85.4 v41.6,85.3 | v43.4,88.4 43.4,90.5 44.3,91.4 44.3,93.11 J2.3
  Bottom 0.254: v41.6,85.3 41.6,87.5 42.5,88.4 v43.4,88.4
FSYNC5_B  (via drill 0.35)
  Top 0.254: U14.3 v86,58.1
  Bottom 0.254: J6.3 93.23,55.58 93.15,55.7 88.95,55.7 88,56.65 88,57.6 87.5,58.1 v86,58.1
FSYNC5_C
  Top 0.203: U18.3 55.5,14
  Top 0.254: 55.5,14 55.3,13.8 55.3,12 56.3,11 56.3,9.5 55.6,8.8 55.6,6.7 54.51,5.61 J10.3
FSYNC5_D  (via drill 0.35)
  Top 0.203: U22.3 14,41.6 13.6,41.2 11.9,41.2 v10.9,42.2 | 10.8,43.8 v10.87,43.8
  Top 0.254: J14.3 6.89,44.3 8.8,44.3 9.3,43.8 10.8,43.8
  Bottom 0.203: v10.87,43.8 10.9,43.77 v10.9,42.2
FSYNC6_A
  Top 0.203: 42.01,87.19 42.1,87.2 U10.6
  Top 0.254: 42.01,87.19 41.7,87.5 41.7,88.3 42.64,89.24 42.64,91.45 J2.6
FSYNC6_B
  Top 0.203: U14.6 87.2,57.7
  Top 0.254: J6.6 91.66,56.96 90.42,58.2 87.7,58.2 87.2,57.7
FSYNC6_C
  Top 0.203: U18.6 57.7,12.8 57.9,12.6
  Top 0.254: 57.9,12.6 57.9,9.89 56.96,8.95 J10.6
FSYNC6_D
  Top 0.203: U22.6 12.8,42.5 12.6,42.3 11.9,42.3 11.16,43.04 J14.6
FSYNC7_A
  Top 0.254: U10.8 39.3,87.6 39.39,87.59 41.8,90 41.8,93.15 J2.5
FSYNC7_B
  Top 0.203: U14.8 87.6,61.9
  Top 0.254: J6.5 94.39,56.98 93.27,58.1 91.4,58.1 87.6,61.9
FSYNC7_C
  Top 0.203: 61.5,12.4 U18.8
  Top 0.254: J10.5 58.2,6.85 58.2,9.1 61.5,12.4
FSYNC7_D
  Top 0.203: U22.8 12.4,38.9
  Top 0.254: J14.5 6.85,41.8 10.3,41.8 12.4,39.7 12.4,38.9
FSYNC8_A  (via drill 0.35)
  Top 0.203: 36.5,86.4 U10.11
  Top 0.254: 36.5,86.4 35.5,87.4 v35.5,89.1
  Bottom 0.254: v35.5,89.1 37,90.6 39.25,90.6 J2.8
FSYNC8_B  (via drill 0.35)
  Top 0.203: 86.4,63.4 U14.11
  Top 0.254: 86.4,63.4 86.8,63.8 88.34,63.8 v88.94,63.2
  Bottom 0.254: v88.94,63.2 91.85,60.29 J6.8
FSYNC8_C
  Top 0.203: 63.8,13.6 U18.11
  Top 0.254: J10.8 59.5,9.4 61.6,11.5 63.2,11.5 64,12.3 64,13.4 63.8,13.6
FSYNC8_D
  Top 0.203: 13.6,36.5 U22.11
  Top 0.254: J14.8 10.6,40.5 11.4,39.7 11.4,36.7 11.8,36.3 13.4,36.3 13.6,36.5
FSYNC9_A
  Top 0.203: U11.3 63.4,86
  Top 0.254: 63.4,86 63.8,86.4 63.8,88.7 63.3,89.2 63.3,93.11 J3.3
FSYNC9_B
  Top 0.203: U15.3 86,36.67 86.52,36.15
  Top 0.254: 86.52,36.15 86.67,36 89.9,36 90.6,36.7 93.11,36.7 J7.3
FSYNC9_C
  Top 0.203: 36.6,14 U19.3
  Top 0.254: J11.3 36.7,6.89 36.7,10.9 36.2,11.4 36.2,13.6 36.6,14
FSYNC9_D
  Top 0.203: U23.3 14,63.3
  Top 0.254: 14,63.3 13.2,64.1 11,64.1 10.3,63.4 6.79,63.4 J15.3
FSYNC10_A
  Top 0.254: U11.6 61.37,87.2 61.14,87.43 61.14,88.55 62.04,89.45 J3.6
FSYNC10_B
  Top 0.203: 87.3,36.5 87.2,36.6 U15.6
  Top 0.254: 87.3,36.5 89.19,36.5 90.65,37.96 J7.6
FSYNC10_C
  Top 0.203: U19.6 38.8,12.8
  Top 0.254: 38.8,12.8 39.1,12.5 39.1,9.29 J11.6
FSYNC10_D
  Top 0.203: 12.3,63.6 12.43,63.6 12.8,63.23 U23.6
  Top 0.254: J15.6 9.64,62.04 11.2,63.6 12.3,63.6
FSYNC11_A
  Top 0.203: U11.8 59.09,87.6
  Top 0.254: 59.09,87.6 60.8,89.3 60.8,93.15 J3.5
FSYNC11_B
  Top 0.203: U15.8 87.6,42.2
  Top 0.254: J7.5 94.29,37.96 93.3,38.95 93.3,40.8 92.4,41.7 88.1,41.7 87.6,42.2
FSYNC11_C
  Top 0.203: 42.2,12.4 U19.8
  Top 0.254: J11.5 39.2,6.85 39.2,8.7 39.9,9.4 39.9,11.4 40.9,12.4 42.2,12.4
FSYNC11_D
  Top 0.203: 12.4,57.9 U23.8
  Top 0.254: J15.5 5.61,61.64 6.9,60.35 6.9,59 7.6,58.3 9.5,58.3 9.8,58.6 11.7,58.6 12.4,57.9
FSYNC12_A  (via drill 0.35)
  Top 0.203: U11.11 55.7,86.4 55.3,86.8 | 56,88.9 56.03,88.93 v56.9,88.93
  Top 0.254: 55.3,86.8 55.3,88.2 56,88.9
  Bottom 0.254: v56.9,88.93 56.9,89.25 J3.8
FSYNC12_B
  Top 0.203: 86.4,42.47 U15.11
  Top 0.254: 86.4,42.47 86.4,41.27 87.35,40.32 91.67,40.32 J7.8
FSYNC12_C
  Top 0.203: U19.11 44.4,13.6
  Top 0.254: 44.4,13.6 44.7,13.3 44.7,12 44,11.3 41.1,11.3 40.5,10.7 J11.8
FSYNC12_D
  Top 0.203: U23.11 13.6,57.6
  Top 0.254: 13.6,57.6 11.7,59.5 J15.8
FSYNC13_A
  Top 0.2: 83.8,86 U12.3
  Top 0.254: 83.8,86 83.9,86.1 83.9,88.9 82.4,90.4 82.4,93.23 J1.5
FSYNC13_B
  Top 0.203: U16.3 86,17.4
  Top 0.254: 86,17.4 86.4,17 90,17 90.6,17.6 93.23,17.6 J18.5
FSYNC13_C
  Top 0.203: 17.6,14 U20.3
  Top 0.254: J20.5 17.7,6.87 17.7,10 16.9,10.8 16.9,13.3 17.6,14
FSYNC13_D
  Top 0.203: U24.3 13.97,82.7 13.97,83.63 13.75,83.85 10.85,83.85 9.4,82.4 6.77,82.4 J8.5
FSYNC14_A
  Top 0.254: U12.6 81.7,87.2 81.42,87.48 81.42,91.45 J1.8
FSYNC14_B
  Top 0.203: U16.6 87.2,17.6
  Top 0.254: 87.2,17.6 87.39,17.41 89.75,17.41 91.33,18.98 J18.8
FSYNC14_C
  Top 0.203: U20.6 17.5,12.8
  Top 0.254: 17.5,12.8 17.4,12.7 17.4,11 19,9.4 19,8.17 J20.8
FSYNC14_D
  Top 0.203: U24.6 12.8,81.8 12.02,81.02 J8.8
FSYNC15_A
  Top 0.254: J1.7 79.8,93.17 79.8,91.4 79.2,90.8 77.8,90.8 76.93,89.93 U12.8
FSYNC15_B  (via drill 0.35)
  Top 0.203: U16.8 87.6,23.9
  Top 0.254: 87.6,23.9 88.6,22.9 v88.74,22.9
  Bottom 0.254: v88.74,22.9 88.94,22.7 92.3,22.7 93.1,21.9 93.1,20.27 J18.7
FSYNC15_C
  Top 0.203: 22.9,12.4 U20.8
  Top 0.254: J20.7 20.3,6.93 20.3,9.9 22.8,12.4 22.9,12.4
FSYNC15_D
  Top 0.203: J8.7 6.83,79.8 10.5,79.8 12.4,77.9 U24.8
FSYNC16_A
  Top 0.2: U12.11 75.93,86.4 75.5,86.83
  Top 0.254: 75.5,86.83 75.5,89.1 78.25,91.85 J1.10
FSYNC16_B  (via drill 0.35)
  Top 0.254: U16.11 86.4,22.1 86.9,21.6 v87.7,21.6
  Bottom 0.254: J18.10 91.77,21.6 v87.7,21.6
FSYNC16_C
  Top 0.203: U20.11 25.5,13.6 25.7,13.4
  Top 0.254: 25.7,13.4 25.7,11.9 25.3,11.5 23.2,11.5 21.52,9.82 J20.10
FSYNC16_D
  Top 0.203: J8.10 8.77,79.1 10.5,79.1 11.6,78 11.6,76.1 12,75.7 13.33,75.7 13.6,75.97 U24.11
GND  (via drill 0.35)
  other vias: 12.3,85.8 14.1,84.4 22.5,80.3 24.2,78.5 20.6,78.6 14.1,85.8 22,77.2 25.8,76.8 24,74.6 22.4,73.5 24,72 22.5,70.1 24,67.5 22.5,65.4 23.9,64 24.1,62.2 22.5,62.3 19.7,63.2 19.7,61 16.8,63.8 14.2,65.3 13.3,66.7 12.1,65.3 15.3,66.7 11.5,66.7 21.9,58.8 22.7,60.1 24,59.9 26.5,59.8 28.8,57.4 26.3,57.6 24.3,58.5 24.6,56 27,53.6 26.8,56 28.6,55.4 31.3,54.9 33.1,53 31.6,51.2 31,52.9 29.5,53.3 29.9,50.8 28,48.2 30.4,48.2 25.2,48 25.2,49.7 22.8,48.1 20.1,47.8 22.8,49.7 16.2,47.9 10.8,46.9 10.6,49.6 26.3,88.3 29.8,87.6 29.8,86 32,83.9 34.1,83.8 33.6,82.3 35.7,82.3 37.1,78.8 39,78.9 41.1,76.8 39,76.9 42.9,75.1 41,74.9 44.6,73.4 42.7,73.2 44.4,71.4 46.4,71.5 47.8,70.1 46.4,69.5 47.8,68.1 48.2,72.8 48.1,74.9 47.9,84.8 51.6,88.9 66.1,88.7 66.1,86.8 66.1,84.8 64.3,84.8 62.6,81.2 62.8,79.2 60.8,79.3 58.7,75.2 57.2,74.2 55.4,75.7 52.8,75.6 53.6,74.1 52.2,72.8 51.2,73.9 49.8,75.2 52.3,69.8 52.2,67.6 55,67 53.8,65.9 59.2,67 57.4,65.5 60.8,65.4 62.6,67 64.1,65.4 66,67 67.7,65.4 69.4,67 71.2,65.4 81.4,82.3 81.7,79.9 79.4,80.2 79.3,76.7 79.3,75.4 77.2,78.6 77.2,80.2 76,81.5 84.3,85.1 86.1,85.8 86.1,87.9 73.7,81.4 90.1,72.6 87.4,73.1 81.7,69.5 82.4,72.5 77.8,76.4 77.8,74.2 79.3,73.1 77.8,71.9 79.5,69.4 79.9,67.8 78.4,66.2 74.6,64.6 74.6,62 72.7,62.7 73,60.7 70.8,60.7 70.8,58.6 68.5,58.4 68.5,56.3 66.4,56.3 66.5,54.3 64.3,54.2 64.4,52.3 62.3,52.3 80.2,54.7 78.9,55.9 72.9,55.9 78.3,53.6 73.9,53.6 71.4,54.5 71.9,52.7 69.8,52.8 70.3,51.1 68.3,51.7 68.3,49.6 69.4,48.6 66.7,47.9 67.8,46.7 69.4,45.3 71.5,46.5 73.2,44.7 70.8,43.9 72.6,42.2 74.9,43 76.6,41.3 74.3,40.5 78.2,39.7 79.7,38.4 75.9,38.9 77.4,37.3 78.9,35.1 77.4,35.1 77.4,32.7 79,32.7 79.4,30.3 76.9,30.3 75.8,28.7 77.4,28.7 76.5,27.1 77.4,26 75.7,26.2 78.9,27.2 79,24.7 80.2,21.8 77.4,23.5 78.9,21 83.4,35.2 83.4,33.8 85.9,35.2 85.9,33.8 87.3,35.2 87.3,33.8 88.8,28.9 86.9,30.3 84.2,30.3 83.1,28.6 85,28.6 88.7,25.7 87,28.6 86.1,27.2 84.1,27.2 87.4,16.2 85.9,16.2 81.5,20.5 83.4,18.6 79.9,20 75.1,11.1 73.6,11.1 70.5,14.3 68.2,16.7 68.7,18.3 63.9,23.2 61.6,23.2 61.5,25.7 58.9,28.3 59,25.8 56.7,28.2 56.7,30.5 54.6,30.3 54.6,32.5 52.3,34.7 52.5,32.4 51.8,11.9 50.2,11.9 51.8,13.7 50.2,13.7 52.1,17.1 52.1,19.3 52.1,21.3 52.1,23.5 51.8,26.3 50.2,27.7 51.7,29.4 47.8,30.9 48,29.6 46,27.6 47.2,26.5 44.1,27.6 44.1,26 43.9,32.7 45.3,31.2 46.6,32.7 42.4,31.1 41.1,32.7 38.5,32.7 39.9,31.1 37.3,31.1 35.7,32.7 34.3,31.1 32.6,32.7 31.2,31.1 29.7,32.7 28.1,31.1 26.7,32.7 38.3,22.3 37.2,21.2 40.4,22.3 33.4,13 35,13 33.4,11.4 28.9,13.6 33.2,19.8 31.8,19.8 33.2,21.9 31.8,21.9 24.1,18.6 22.1,20.2 22.1,22.2 22.1,27.3 21.2,28.8 20.4,27.8 22.1,25.4 20.4,26.3 20.3,23.2 22.1,24 20.3,21.2 18.8,17.3 17.2,17.9 17.3,15.8 15.4,16.2 16.4,14.5 16.2,12 14.8,9.3 11,25.8 11,28.1 13.9,29.9 12.1,27.1 16.1,28.4 16.1,29.8 21.9,32 20.5,32.9 22,34.5 25.6,37.9 27.8,37.7 27.7,39.8 30,39.9 32.1,42 30,42 32,44 34.2,44.1 36.5,46.4 34.3,46.3 38.2,48.1 36.4,48.4 34.1,65.4 35.6,60.7 35.25,62.6 38.4,66.9 39.5,66.9 36.1,65.3 36.2,58.8 43.8,59.2 33.4,72.8 34.8,72.8 36.4,74.35 38.85,74.3 86.1,89.8 84.5,89.8 82.1,89.7 82.9,88.9 84.6,87.9 62.4,88.3 30.3,12.7 39.3,21.2 37.9,19.8 35.7,19.8 33.4,14.6 34.9,14.6 34.9,11.4 30.4,14.6 29.4,11.4 18.9,19.7 11,82.7 11.1,22.8 37.6,11.3 57.1,11.1 73.9,13.1 88.8,37.6 18.5,11.1 82.1,83.05 88.4,18.6 10.9,45 16.8,65.9 30.4,91.1 30.4,92.7 31.3,92.7 31.3,91.1 87.4,89.8 87.4,87.9 30.4,89 31.6,89 30.1,62.9 29.9,61.6 30.4,60.7 29.9,59.8 31,59.8 31,62.4 30.5,58.9 28.1,62.5 27.7,61.6 28.1,60.7 27.6,59.8 27.5,58.8 27.1,62.5 26.5,61.6 27.1,60.7 11,29.8 11,31.4 21.2,31 21.8,29.9 84.7,13 85.6,12.2 86.8,11.8 87.9,11.8 87.9,70 87.9,71.7 87.1,70.9 87.3,68.2 86.5,67.3 87.9,67.3 77.9,64.5 77.9,63.2 77.9,62.1 77.9,60.9 84.6,86.5 13.2,86.6 11.4,86.4 16.4,82.7 17.3,81.8 18.1,80.9 90.1,71.5 90.1,70.3 90.2,68.1 90.2,67 77.7,89.7 88.9,57.4 83.9,57.2 78.3,16.7
  pour Bottom: 0,100 100,100 100,0 -0.1,0 -0.1,100
  pour Top: 0,100 0,0 100,0 100,100
I0_A
  Top 0.203: U9.2 U9.1
  Top 0.254: U1.9 33.4,79.56 | 33.4,79.56 31.54,79.56 25.9,85.2 U9.1 | R3.2 33,79.16 33.4,79.56
I0_B  (via drill 0.35)
  Top 0.2: v85.77,73.2 85.2,72.63 85.2,72.5
  Top 0.203: U13.2 U13.1 85.2,72.5 85.2,69.5
  Top 0.254: U2.9 83.24,54.93 81.64,56.53 81.64,65.94 85.2,69.5 | R19.2 80.9,73.4 v80.3,72.8
  Bottom 0.254: v80.3,72.8 80.7,73.2 v85.77,73.2
I0_C  (via drill 0.35)
  Top 0.2: U17.1 78.51,14.8 v78.54,14.83
  Top 0.203: U17.1 U17.2
  Top 0.254: U3.9 68.36,21.44 75,14.8 U17.1 | R35.2 75.95,19.1 75.48,19.57 v74.98,19.57
  Bottom 0.254: v78.54,14.83 78.5,14.87 77.33,14.87 74.98,17.23 v74.98,19.57
I0_D  (via drill 0.35)
  Top 0.2: R51.2 13.35,26.75 14.4,25.7 U21.2
  Top 0.203: U21.1 U21.2 14.4,23.1
  Top 0.254: U4.9 16.82,46.3 16.82,44.9 18.12,43.6 18.12,22.31 v17.7,21.9 | v14.4,22.6 14.4,23.1
  Bottom 0.254: v17.7,21.9 17.66,21.94 15.06,21.94 v14.4,22.6
I1_A  (via drill 0.35)
  Top 0.203: U9.5 U9.4
  Top 0.254: U1.8 31.48,80.22 29.2,82.5 | U9.4 25.3,86.4 29.2,82.5 | v30.2,82.5 29.2,82.5
  Bottom 0.254: R4.2 32.56,78.69 32.56,81.27 31.37,82.46 30.24,82.46 v30.2,82.5
I1_B  (via drill 0.35)
  Top 0.2: v87.1,74.1 86.8,74.4 U13.5
  Top 0.203: U13.5 U13.4 86.4,71.72
  Top 0.254: U2.8 83.91,54.85 82.15,56.6 82.15,65.88 86.4,70.12 86.4,71.72
  Bottom 0.254: R20.2 87.05,74.05 v87.1,74.1
I1_C  (via drill 0.35)
  Top 0.2: v78.5,13.37 78.27,13.6 U17.4
  Top 0.203: U17.4 U17.5
  Top 0.254: U3.8 68.45,20.77 75.62,13.6 U17.4
  Bottom 0.254: R36.2 75.95,17.05 77.4,15.6 78.8,15.6 79.3,15.1 79.3,13.8 78.87,13.37 v78.5,13.37
I1_D  (via drill 0.35)
  Top 0.203: U21.4 U21.5 13.2,23.2
  Top 0.254: U4.8 16.09,45.05 17.71,43.43 17.71,22.94 16.21,21.44 v16.21,21.18 | v13.2,22.6 13.2,23.2
  Bottom 0.254: v16.21,21.18 14.62,21.18 v13.2,22.6 13.2,26.55 R52.2
I2_A  (via drill 0.35)
  Top 0.203: U9.9 U9.10 19.9,86.8
  Top 0.254: U1.7 31.84,80.86 v31.7,81 | 19.9,86.8 22.5,84.2 26.3,84.2 28.9,81.6 v28.9,81 28.95,81 30.8,79.15 R5.2
  Bottom 0.254: v31.7,81 v28.9,81
I2_B  (via drill 0.35)
  Top 0.2: U13.9 87.2,82.3 87.4,82.5 88.1,82.5 88.4,82.2 v88.4,81.5
  Top 0.203: U13.9 U13.10 86.8,79.9
  Top 0.254: U2.7 84.5,53.67 84.5,54.83 82.66,56.67 82.66,65.45 v82.9,65.7 | v82.91,68.21 84.41,69.71 84.41,77.51 86.8,79.9 | R21.2 79.94,77.78 v79.31,77.78
  Bottom 0.254: v82.9,65.7 v82.9,68.2 v82.91,68.21 | v79.31,77.78 79.31,78.54 82.28,81.5 v88.4,81.5
I2_C  (via drill 0.35)
  Top 0.203: U17.10 U17.9
  Top 0.254: U3.7 67.76,20.14 v67.8,20.1 | v70.8,20.1 70.8,19.7 75,15.5 79,15.5 81.3,13.2 U17.10
  Bottom 0.254: v67.8,20.1 v70.8,20.1 70.8,20.15 68.35,22.6 R37.2
I2_D  (via drill 0.35)
  Top 0.203: U21.9 U21.10 13.2,19.9
  Top 0.254: U4.7 15.46,45.11 17.31,43.26 17.31,23.21 14.9,20.8 v14.9,20.4 | v13.2,20.2 13.2,19.9
  Bottom 0.254: v14.9,20.4 13.4,20.4 v13.2,20.2 11.2,20.2 11.05,20.05 11.05,16.1 R53.2
I3_A  (via drill 0.35)
  Top 0.203: U9.12 U9.13 19.81,85.6 20.03,85.5
  Top 0.254: U1.6 32.28,81.52 32,81.8 v31,81.8 | 20.03,85.5 21.83,83.7 25.7,83.7 v27.7,81.7 27.7,81.1 28.9,79.9 v28.9,78.7
  Bottom 0.254: v31,81.8 30.9,81.7 v27.7,81.7 | v28.9,78.7 30.35,78.7 R6.2
I3_B  (via drill 0.35)
  Top 0.203: U13.12 U13.13 85.6,79.8
  Top 0.254: U2.6 85.23,53.67 85.23,54.67 83.16,56.74 83.16,64.95 83.65,65.45 v83.65,66.45 | 84,78.2 84,70.3 v82.9,69.2 | 84,78.2 85.6,79.8 | v83.5,78.8 84,78.3 84,78.2
  Bottom 0.254: v83.65,66.45 83.65,68.55 83,69.2 v82.9,69.2 | R22.2 83.45,78.75 v83.5,78.8
I3_C  (via drill 0.35)
  Top 0.203: U17.13 U17.12
  Top 0.254: v68.85,19.44 53.63,19.44 U3.6 | U17.13 80.7,14.4 79.1,16 75.5,16 v72,19.5 71.96,19.54 71.96,20.07 69.13,22.9 R38.2
  Bottom 0.254: v68.85,19.44 71.94,19.44 v72,19.5
I3_D  (via drill 0.35)
  Top 0.203: U21.13 U21.12 14,19.9
  Top 0.254: U4.6 14.87,46.3 14.87,45.13 16.9,43.09 16.9,23.4 14.05,20.55 | 14.05,20.55 14,20.5 14,19.9 | R54.2 12.9,15.35 v12.9,16.11 | v11.71,19.4 11.71,20.21 12.6,21.1 13.5,21.1 14.05,20.55
  Bottom 0.254: v12.9,16.11 11.71,17.3 v11.71,19.4
I4_A  (via drill 0.35)
  Top 0.203: U10.2 U10.1
  Top 0.254: U1.5 46.27,82.06 43.45,82.06 42.8,82.7 42.8,84.63 U10.1 | U10.2 44.47,85.6 44.73,85.86 45.64,85.86 v45.7,85.8
  Bottom 0.254: R7.2 45.75,85.85 v45.7,85.8
I4_B  (via drill 0.35)
  Top 0.203: U14.1 U14.2 85.59,54.98
  Top 0.254: 85.59,54.98 85.8,54.77 85.8,53.67 U2.5 85.83,52.44 85.2,51.8 82.76,51.8 v82,51.04
  Bottom 0.2: R23.2 81.9,50.94 v82,51.04
I4_C
  Top 0.203: U18.2 56.63,14.9
  Top 0.254: U3.5 55.95,18.84 | U18.1 56.63,14.9 56.63,18.17 55.95,18.84 | 55.95,18.84 57.02,18.84 57.03,18.86 61.59,18.86 R39.2
I4_D  (via drill 0.35)
  Top 0.203: U22.1 U22.2 14.4,45 14.16,45.23 U4.5
  Top 0.254: R55.2 19.6,40.65 v19.6,41.6 | v16.2,41.6 15.4,41.6 14.8,42.2 U22.1
  Bottom 0.254: v19.6,41.6 v16.2,41.6
I5_A  (via drill 0.35)
  Top 0.203: 41.7,86.4 U10.4 U10.5
  Top 0.254: U1.4 46.34,82.78 v44.4,82.78 | v40.5,82.7 40.5,85.2 41.7,86.4 | U10.4 45.1,86.4 45.75,87.05 R8.2
  Bottom 0.254: v44.4,82.78 40.59,82.78 v40.5,82.7
I5_B  (via drill 0.35)
  Top 0.203: 86.4,54.8 U14.4 U14.5
  Top 0.254: 86.4,54.8 86.5,54.7 U2.4 86.5,52.32 85.27,51.09 84.05,51.09 v84,51.04
  Bottom 0.254: R24.2 v84,51.04
I5_C  (via drill 0.35)
  Top 0.203: 57.7,13.6 U18.4 U18.5
  Top 0.254: U3.4 v55.3,18.18 v55.3,18.19 | v57.3,18.2 58,17.5 58,13.9 57.7,13.6
  Bottom 0.254: v55.3,18.19 57.29,18.19 | 57.29,18.19 v57.3,18.2 | R40.2 60.63,17.8 60.27,18.16 57.32,18.16 57.29,18.19
I5_D  (via drill 0.35)
  Top 0.2: U22.5 v13.2,41.9
  Top 0.203: U22.5 U22.4 13.6,45 13.5,45.1 U4.4
  Bottom 0.254: R56.2 14.65,40.45 v13.2,41.9
I6_A  (via drill 0.35)
  Top 0.203: 38.8,86.8 U10.10 U10.9
  Top 0.254: 38.8,86.8 39.8,85.8 v39.8,83.44 | v43.7,83.44 46.33,83.44 U1.3
  Bottom 0.254: v43.7,83.44 v39.8,83.44 35.86,83.44 33.7,85.6 33.7,86.2 34.35,86.85 R9.2
I6_B  (via drill 0.35)
  Top 0.203: U14.9 U14.10 v86.8,60.8
  Top 0.254: U2.3 v87.16,55.1 v87.15,55.1
  Bottom 0.2: R25.2 86.8,64.05 v86.8,60.8
  Bottom 0.254: v87.15,55.1 87.15,55.2 84.8,57.55 84.8,60.1 85.5,60.8 v86.8,60.8
I6_C  (via drill 0.35)
  Top 0.203: 61.2,13.2 U18.10 U18.9
  Top 0.254: v59.7,17.5 59.7,14.7 61.2,13.2 | U3.3 55.92,17.52 v55.97,17.47 55.97,15.72 R41.2
  Bottom 0.254: v55.97,17.47 59.67,17.47 v59.7,17.5
I6_D  (via drill 0.35)
  Top 0.203: U22.9 U22.10 v13.2,40.2 | U4.3 12.84,45.02 v12.87,45
  Top 0.254: R57.2 16,32.55 16,38.7 14.5,40.2 v13.2,40.2
  Bottom 0.203: v12.87,45 12.4,44.53 12.4,41 v13.2,40.2
I7_A  (via drill 0.35)
  Top 0.203: U10.12 U10.13
  Top 0.254: U1.2 46.36,84.1 v44.4,84.1 | v39.1,84.1 v39.09,84.11 39.09,85.14 38.63,85.6 U10.13 | R10.2 34.35,85.98 v34.6,85.73
  Bottom 0.254: v44.4,84.1 v39.1,84.1 36.23,84.1 v34.6,85.73
I7_B  (via drill 0.35)
  Top 0.2: U14.13 85.6,64.85 R26.2
  Top 0.203: U14.12 U14.13 85.6,60 v85.7,59.9
  Top 0.254: U2.2 87.79,54.59 88.1,54.9 v88.1,55.1
  Bottom 0.254: v88.1,55.1 88.1,55.2 86.06,57.24 85.73,57.24 85.21,57.76 85.21,59.41 v85.7,59.9
I7_C  (via drill 0.35)
  Top 0.203: 61.1,14.4 U18.13 U18.12
  Top 0.254: U3.2 53.64,16.9 55.26,16.9 v55.3,16.87 | 61.1,14.4 60.5,15 v60.5,16.9
  Bottom 0.254: v60.5,16.9 60.42,16.82 55.34,16.82 v55.3,16.87 55.3,15.45 R42.2
I7_D  (via drill 0.35)
  Top 0.203: U22.13 U22.12 v14,39.2 | U4.2 12.21,45.31 v11.9,45
  Top 0.254: R58.2 15.5,34.15 15.5,38.3 14.6,39.2 v14,39.2
  Bottom 0.203: v11.9,45 11.9,40.4 13.1,39.2 v14,39.2
I8_A  (via drill 0.35)
  Top 0.203: U11.1 U11.2
  Top 0.254: U11.1 58.8,85.2 57.71,84.11 U1.23 | U11.2 63.33,85.6 63.33,85.59 65.59,85.59 65.6,85.6 v67.7,85.6
  Bottom 0.254: v67.7,85.6 67.7,87.05 R12.2
I8_B  (via drill 0.35)
  Top 0.203: U15.1 U15.2 v85.6,39 | U2.23 87.79,45.51 88.34,44.96 v88.34,44.9
  Top 0.254: R27.2 83.45,31.9 85.2,33.65 U15.1
  Bottom 0.254: v88.34,44.9 88.34,40.34 87,39 v85.6,39
I8_C  (via drill 0.35)
  Top 0.2: v47.88,16.91 47.86,16.89 U3.23
  Top 0.203: U19.2 U19.1 39.6,14.8
  Top 0.254: 39.6,14.8 40.7,15.9 44,15.9 44.99,16.89 U3.23
  Bottom 0.2: R43.2 48.95,16.9 v47.9,16.9 v47.88,16.91
I8_D  (via drill 0.35)
  Top 0.203: U23.1 U23.2 14.4,60.99 v14.31,60.9 | U4.23 12.21,54.69 11.86,55.04 v11.86,55.1
  Bottom 0.203: v11.86,55.1 11.86,59.96 12.83,60.93 14.28,60.93 v14.31,60.9
  Bottom 0.254: R59.2 14.51,60.7 v14.31,60.9
I9_A  (via drill 0.35)
  Top 0.203: U11.5 U11.4 v60.9,86.4
  Top 0.254: U1.22 57.68,83.48 58.7,84.5 v60.9,84.5 | v64.46,87.5 R11.2
  Bottom 0.254: v60.9,84.5 v60.9,86.4 62,87.5 v64.46,87.5
I9_B  (via drill 0.35)
  Top 0.203: U2.22 87.16,45.18 v87.43,44.9 | v86.4,40.1 U15.4 U15.5
  Top 0.254: v84.31,35.2 v84.31,33.8
  Bottom 0.254: v87.43,44.9 87.73,44.6 87.73,40.63 87.2,40.1 v86.4,40.1 85.96,39.66 85.33,39.66 84.31,38.64 v84.31,35.2 | v84.31,33.8 84.06,33.55 84.06,33.53 83.45,32.92 R28.2
I9_C  (via drill 0.35)
  Top 0.2: U3.22 47.5,17.52 v47.8,17.82
  Top 0.203: U19.5 U19.4 v39.3,13.6
  Top 0.254: U3.22 44.82,17.52 43.7,16.4 40,16.4 v39.3,15.7
  Bottom 0.2: v47.8,17.82 47.8,18.5 48.4,19.1 R44.2
  Bottom 0.254: v39.3,15.7 v39.3,13.6
I9_D  (via drill 0.35)
  Top 0.203: U23.5 U23.4 13.6,60.4 v13.5,60.3 | U4.22 12.84,55.08 v12.87,55.1
  Bottom 0.203: v12.87,55.1 12.27,55.7 12.27,59.47 13.1,60.3 v13.5,60.3
  Bottom 0.254: R60.2 15.2,58.6 v13.5,60.3
I10_A  (via drill 0.35)
  Top 0.203: U11.10 U11.9
  Top 0.254: v58.7,83.2 58,83.2 57.6,82.8 53.65,82.8 U1.21 | v58.8,86.8 U11.10 | v54.64,87.5 R13.2
  Bottom 0.254: v58.7,83.2 58.8,83.3 v58.8,86.8 58.1,87.5 v54.64,87.5
I10_B  (via drill 0.35)
  Top 0.2: U15.10 87.06,43.11 v87.06,41.7
  Top 0.203: U2.21 86.5,44.9 86.8,44.6 U15.10 U15.9
  Top 0.254: v85.26,40.74 84.76,40.74 84.05,41.45 R29.2
  Bottom 0.254: v87.06,41.7 86.46,41.7 85.5,40.74 v85.26,40.74
I10_C  (via drill 0.35)
  Top 0.203: U19.9 U19.10 v41.7,13.2
  Top 0.254: U3.21 44.78,18.18 43.7,17.1 v40.9,17.1
  Bottom 0.254: v40.9,17.1 40.9,14 v41.7,13.2 44.1,15.6 45.3,15.6 46.45,14.45 R45.2
I10_D  (via drill 0.35)
  Top 0.203: U23.9 U23.10 13.2,55.7 13.5,55.4 U4.21
  Top 0.254: v13.5,52 U4.21
  Bottom 0.254: R61.2 13.85,51.65 v13.5,52
I11_A  (via drill 0.35)
  Top 0.203: U11.13 U11.12
  Top 0.254: U1.20 57.95,82.16 v58,82.2 | v58,86 U11.12
  Bottom 0.254: v58,82.2 v58,86 57.2,86.8 53.85,86.8 R14.2
I11_B  (via drill 0.35)
  Top 0.2: U15.13 85.6,42 v85.5,41.9
  Top 0.203: U15.12 U15.13 85.6,44.6 85.83,44.84 U2.20
  Bottom 0.254: v85.5,41.9 85.05,41.45 R30.2
I11_C  (via drill 0.35)
  Top 0.2: R46.2 48.15,12.95 47.8,13.3 45.6,13.3 44.5,14.4 U19.13
  Top 0.203: U19.12 U19.13 v41.7,14.4
  Top 0.254: U3.20 45.27,18.84 44.8,18.84 43.8,17.84 v41.8,17.84
  Bottom 0.254: v41.8,17.84 41.7,17.74 v41.7,14.4
I11_D  (via drill 0.35)
  Top 0.203: U23.13 U23.12 14,55.6 14.16,55.44 U4.20
  Top 0.254: v14.6,52 14.16,52.44 U4.20
  Bottom 0.254: R62.2 14.85,51.75 v14.6,52
I12_A
  Top 0.2: U12.1 U12.2
  Top 0.254: U1.19 56.61,81.52 56.63,81.5 59.3,81.5 61.4,83.6 76.9,83.6 77.6,84.3 80.4,84.3 81.3,85.2 | U12.1 81.3,85.2 | 81.3,85.2 81.35,85.25 80.35,86.25 80.35,89.45 R15.2
I12_B
  Top 0.2: R31.2 84.3,17 85.2,17.9 U16.1
  Top 0.203: U16.2 U16.1 85.2,20.7
  Top 0.254: U2.19 85.2,45.3 82.1,42.2 82.1,23.8 85.2,20.7
I12_C
  Top 0.2: R47.2 15.56,12.5 17.44,14.38 18.61,14.38 U20.2
  Top 0.203: U20.2 U20.1 20.4,14.8 | 46.31,19.54 U3.19
  Top 0.254: 46.31,19.54 40.51,19.54 36.31,15.34 20.94,15.34 20.4,14.8
I12_D
  Top 0.203: 14.4,81.4 U24.2 U24.1
  Top 0.254: U4.19 14.8,54.8 17.5,57.5 17.5,72.3 | 14.4,81.4 14.4,80.5 17.5,77.4 17.5,72.3 | R63.2 16.9,71.7 17.5,72.3
I13_A  (via drill 0.35)
  Top 0.2: U12.4 U12.5
  Top 0.254: U1.18 59.23,80.86 61.57,83.19 77.07,83.19 77.77,83.89 81.01,83.89 v81.2,83.7 | v81.1,86.5 81.2,86.4 U12.4
  Bottom 0.254: v81.2,83.7 81.2,86.4 v81.1,86.5 80.45,87.15 R16.2
I13_B  (via drill 0.35)
  Top 0.203: U16.5 U16.4 v86.4,20.1
  Top 0.254: U2.18 84.54,45.31 81.59,42.37 81.59,23.63 83.7,21.52 v83.7,20.1 82.35,20.1 v81.11,18.86
  Bottom 0.254: v83.7,20.1 v86.4,20.1 | R32.2 81.85,17.92 81.11,18.66 v81.11,18.86
I13_C  (via drill 0.35)
  Top 0.2: v14.3,10.6 14.4,10.5 16.01,10.5 v16.2,10.69
  Top 0.203: U20.5 U20.4 v20.2,13.6
  Top 0.254: U3.18 40.53,20.14 36.14,15.75 20.25,15.75 v20.2,15.8
  Bottom 0.2: R48.2 14.3,12.05 v14.3,10.6 | v16.2,10.69 19.11,13.6 v20.2,13.6
  Bottom 0.254: v20.2,15.8 v20.2,13.6
I13_D  (via drill 0.35)
  Top 0.203: v13.2,81 U24.5 U24.4
  Top 0.254: U4.18 15.46,54.78 17.91,57.23 17.91,77.69 15.2,80.4 v15.2,81 | v13.9,79 13.2,79.7 v13.2,81
  Bottom 0.254: v15.2,81 v13.2,81 | R64.2 15.2,72.45 15.2,76.5 13.9,77.8 v13.9,79
I14_A  (via drill 0.35)
  Top 0.2: U12.10 U12.9
  Top 0.254: U1.17 59.17,80.22 61.74,82.79 77.31,82.79 77.63,83.11 79.35,83.11 v79.4,83.16 | v78.9,87.6 78.1,86.8 U12.10 | R17.2 72.55,88.75 v72.8,89
  Bottom 0.254: v79.4,83.16 79.1,83.46 79.1,87.4 v78.9,87.6 78.8,87.6 77.4,89 v72.8,89
I14_B  (via drill 0.35)
  Top 0.203: U16.9 U16.10 86.8,23.1 87.2,22.7
  Top 0.254: v81.7,22 81.7,22.9 81.09,23.51 81.09,42.48 83.91,45.3 U2.17 83.91,47.9 82.6,49.2 v80.5,49.2 | 87.2,22.7 v87.2,22.6
  Bottom 0.254: v87.2,22.6 86.4,21.8 81.9,21.8 v81.7,22 | R33.2 80.1,48.8 v80.5,49.2
I14_C  (via drill 0.35)
  Top 0.203: U20.10 24.37,13.1 U20.9 | v21.9,13.2 24.27,13.2
  Top 0.254: U3.17 40.51,20.77 35.88,16.16 22.15,16.16 v21.9,16.41 21.75,16.56 R49.2 | 24.27,13.2 24.37,13.1
  Bottom 0.254: v21.9,16.41 v21.9,13.2
I14_D  (via drill 0.35)
  Top 0.203: v12.8,78.5 U24.9 U24.10
  Top 0.254: U4.17 16.09,54.75 18.31,56.96 18.31,78.45 v17.36,79.4
  Bottom 0.2: R65.2 12.8,75.05 v12.8,78.5
  Bottom 0.254: v17.36,79.4 16.86,79.9 13.4,79.9 12.8,79.3 v12.8,78.5
I15_A  (via drill 0.35)
  Top 0.2: U12.13 U12.12
  Top 0.254: U1.16 59.09,79.56 61.91,82.38 77.48,82.38 77.6,82.5 79.8,82.5 v80.4,83.1 | U12.12 79.2,86 v79.8,85.4 v78.4,85.4
  Bottom 0.254: v79.8,85.4 79.8,83.9 80.4,83.3 v80.4,83.1 | R18.2 74.04,88.59 77,88.59 78.2,87.39 78.2,86.5 78.49,86.21 78.49,85.49 v78.4,85.4
I15_B  (via drill 0.35)
  Top 0.203: U16.12 U16.13 v85.6,22.8
  Top 0.254: v80.93,22.7 80.6,23.03 80.6,42.62 83.28,45.3 83.28,46.33 U2.16 83.28,46.4 83.28,47.41 82.29,48.4 R34.2
  Bottom 0.254: v80.93,22.7 85.5,22.7 v85.6,22.8
I15_C  (via drill 0.35)
  Top 0.203: U20.12 U20.13 v22.9,14.4 | U3.16 46.33,21.47
  Top 0.254: v23,16.81 23.25,16.56 35.72,16.56 40.63,21.47 46.33,21.47
  Bottom 0.254: v22.9,14.4 23,14.5 v23,16.81 23,17.4 22.5,17.9 R50.2
I15_D  (via drill 0.35)
  Top 0.2: R66.2 14,74.25 U24.12
  Top 0.203: 14,78.1 U24.12 U24.13
  Top 0.254: U4.16 16.76,54.73 18.72,56.7 18.72,79.05 v18.37,79.4 | v15.3,78.34 15.24,78.4 14.3,78.4 14,78.1
  Bottom 0.254: v18.37,79.4 17.37,78.4 15.36,78.4 v15.3,78.34
MCLK  (via drill 0.35)
  Top 0.254: v53.1,56.8 53.1,61.3 v51,63.4 | v51.27,42.87 51.27,42.77 48.9,40.4 v48.9,39 | v43.8,47.5 41.6,49.7 v41.6,50.9
  Bottom 0.254: U6.1 51.35,49.03 CRYSTAL.4 | CRYSTAL.4 v51.27,42.87 | v48.9,39 49,38.9 49,37.06 49.03,37.02 U7.1 | CRYSTAL.4 51.57,48.95 53.1,50.48 v53.1,56.8 | v51,63.4 51,65.04 U5.1 | CRYSTAL.4 51.27,48.67 50.1,47.5 v43.8,47.5 | v41.6,50.9 39.99,50.9 U8.1
MCLK0_A
  Bottom 0.254: U5.3 49.67,67.23 30.15,86.75 28.93,86.75 24.06,91.62 J17.6
MCLK0_B  (via drill 0.35)
  Top 0.254: v74,62.9 v78.8,67.7
  Bottom 0.254: v78.8,67.7 83.5,72.4 88.88,72.4 91.85,75.37 J4.6 | U6.3 61.43,50.33 v74,62.9
MCLK0_C
  Bottom 0.254: U7.3 50.33,35.57 74.3,11.6 74.3,10.62 75.94,8.98 J19.6
MCLK0_D  (via drill 0.35)
  Top 0.254: v25.5,36.6 22,33.1 v21.8,33.1
  Bottom 0.254: U8.3 38.67,49.67 25.6,36.6 v25.5,36.6 | v21.8,33.1 17.8,29.1 13.12,29.1 8.15,24.13 J5.6
MCLK1_A  (via drill 0.35)
  Top 0.254: v49,76.4 v49,84.1
  Bottom 0.254: U5.5 49.03,76.36 v49,76.4 | v49,84.1 49,87.83 45.58,91.25 J2.4
MCLK1_B  (via drill 0.35)
  Top 0.254: v73.9,54.6 77.7,54.6 v77.8,54.5
  Bottom 0.254: U6.5 69.06,50.97 72.7,54.6 v73.9,54.6 | v77.8,54.5 78.9,54.5 81,52.4 89.18,52.4 J6.4
MCLK1_C  (via drill 0.35)
  Top 0.254: v51,24.9 51,24.2 51.3,23.9 51.3,15.1 v51,14.8
  Bottom 0.254: U7.5 50.97,24.93 v51,24.9 | v51,14.8 51,11.57 J10.4
MCLK1_D  (via drill 0.35)
  Top 0.254: v25.9,49 v21.9,49
  Bottom 0.254: U8.5 25.93,49.03 v25.9,49 | v21.9,49 21.57,48.67 11.04,48.67 8.15,45.78 J14.4
MCLK2_A  (via drill 0.35)
  Top 0.254: v59,76.5 59.1,76.5 63.7,81.1 v63.9,81.1
  Bottom 0.254: U5.7 50.33,71.93 53.4,75 56.9,75 58.4,76.5 v59,76.5 | v63.9,81.1 65.22,82.42 65.22,91.21 J3.4
MCLK2_B
  Bottom 0.254: U6.7 67.23,49.67 82.4,34.5 90.97,34.5 90.98,34.55 J7.4
MCLK2_C  (via drill 0.35)
  Top 0.254: v34.8,17.8 34.9,17.8 41.9,24.8 v41.9,24.9
  Bottom 0.254: U7.7 49.67,30.07 46.4,26.8 43.8,26.8 v41.9,24.9 | v34.8,17.8 34.2,17.2 34.2,9.37 34.77,8.8 J11.4
MCLK2_D
  Bottom 0.254: U8.7 31.37,50.33 15.7,66 9.52,66 8.15,64.63 J15.4
MCLK3_A  (via drill 0.35)
  Top 0.254: v73.5,66.2 78.3,71 v78.4,71
  Bottom 0.254: U5.8 50.97,69.94 54.7,66.2 v73.5,66.2 | v78.4,71 78.6,71.2 78.6,78.4 85.3,85.1 85.3,90.11 J1.6
MCLK3_B  (via drill 0.35)
  Top 0.254: v69.2,46.6 78.2,37.6 v78.2,22.7 | J18.6 91.45,16.04 88.7,16.04 v88.6,15.94
  Bottom 0.254: U6.8 66.77,49.03 v69.2,46.6 | v88.6,15.94 88.1,15.44 85.56,15.44 78.3,22.7 v78.2,22.7
MCLK3_C  (via drill 0.35)
  Top 0.254: v21.1,24.8 21.1,27.3 v25.7,31.9
  Bottom 0.254: v21.1,24.8 21.1,20.7 15.47,15.07 15.47,9.12 J20.6 | v25.7,31.9 48.81,31.9 49.03,31.68 U7.8
MCLK3_D  (via drill 0.35)
  Top 0.254: J8.6 9.43,83.56 v10.97,85.1
  Bottom 0.254: U8.8 23.2,61.84 23.2,77 15.1,85.1 v10.97,85.1
MUX_EN  (via drill 0.35)
  Top 0.254: U1.15 55.3,78.9 55.4,79 56.3,79 56.8,78.5 v56.8,76.6 | U2.15 82.58,45.48 80.7,43.6 v79,43.6
  Bottom 0.254: v56.8,76.6 57.6,77.4 62.8,77.4 71.18,69.02 CN7.9 72.02,69.02 75.29,65.75 75.29,47.31 v79,43.6
MUX_EN_B  (via drill 0.35)
  Top 0.254: U3.15 44,22.1 43.2,22.9 v43.2,23.8 43.1,23.9 v43.1,34.2 | U4.15 17.42,54.72 19.1,56.4 20.7,56.4 v21.1,56 | MUX.6 47.52,48.1 45.87,48.1 43.1,45.34 v43.1,41.2
  Bottom 0.254: v43.2,23.8 33.7,23.8 29.4,28.1 27.2,28.1 25.98,29.32 CN9.1 25.98,29.52 24.43,31.07 24.43,53.17 21.6,56 v21.1,56 | v43.1,41.2 v43.1,34.2
N$3
  Top 0.254: C15.1 38.85,72.09 U$1.6
N$4  (via drill 0.35)
  other vias: 20.9,97.7
N$5  (via drill 0.35)
  other vias: 22.4,97.7
N$6  (via drill 0.35)
  other vias: 34.5,97.7
N$7
  Top 0.254: U$1.4 38.91,68.2 41.2,68.2 | 41.2,68.2 R1.1 | R2.2 41.25,68.25 41.2,68.2
N$8
  Top 0.254: C15.2 36.75,71.65 37.5,70.9 37.5,69.7 37,69.2 U$1.2
  Top 0.305: U$1.2 35.7,69.2 34.9,68.4 34.9,64.4 L1.1
N$12  (via drill 0.35)
  other vias: 2.5,81.9
N$13  (via drill 0.35)
  other vias: 2.4,68.1
N$14  (via drill 0.35)
  other vias: 2.4,74.4
N$15  (via drill 0.35)
  other vias: 2.8,22.4
N$16  (via drill 0.35)
  other vias: 2.8,21
N$17  (via drill 0.35)
  other vias: 2.4,62.5
N$18  (via drill 0.35)
  other vias: 2.7,54.6
N$19  (via drill 0.35)
  other vias: 2.7,53.1
N$20  (via drill 0.35)
  other vias: 2.7,42.8
N$21  (via drill 0.35)
  other vias: 2.7,41.5
N$22  (via drill 0.35)
  other vias: 2.8,34.9
N$23  (via drill 0.35)
  other vias: 2.8,33.4
N$24  (via drill 0.35)
  other vias: 2.8,14.7
N$25  (via drill 0.35)
  other vias: 2.8,13.2
N$26  (via drill 0.35)
  other vias: 2.8,11.7
N$27  (via drill 0.35)
  other vias: 19.9,2.3
N$28  (via drill 0.35)
  other vias: 18.3,2.3
N$29  (via drill 0.35)
  other vias: 28,2.8
N$30  (via drill 0.35)
  other vias: 26.7,2.8
N$31  (via drill 0.35)
  other vias: 37.3,2.8
N$32  (via drill 0.35)
  other vias: 38.4,2.8
N$33  (via drill 0.35)
  other vias: 46.5,2.8
N$34  (via drill 0.35)
  other vias: 45,2.8
N$35  (via drill 0.35)
  other vias: 57.3,2.9
N$36  (via drill 0.35)
  other vias: 58.7,2.9
N$37  (via drill 0.35)
  other vias: 65.8,2.3
N$38  (via drill 0.35)
  other vias: 41.8,97.6
N$39  (via drill 0.35)
  other vias: 54.6,97.6
N$40  (via drill 0.35)
  other vias: 61.5,97.7
N$41  (via drill 0.35)
  other vias: 62.7,97.7
N$42  (via drill 0.35)
  other vias: 75.1,97.6
N$43  (via drill 0.35)
  other vias: 97.6,79.3
N$44  (via drill 0.35)
  other vias: 97.6,78.2
N$45  (via drill 0.35)
  other vias: 97.6,66.1
N$46  (via drill 0.35)
  other vias: 97.6,65
N$47  (via drill 0.35)
  other vias: 97.6,58.6
N$48  (via drill 0.35)
  other vias: 97.6,57.5
N$49  (via drill 0.35)
  other vias: 97.6,45.8
N$50  (via drill 0.35)
  other vias: 97.6,44.8
N$51  (via drill 0.35)
  other vias: 97.6,38.5
N$52  (via drill 0.35)
  other vias: 97.6,37.3
N$53  (via drill 0.35)